# Altium schematic sheet Sheet1.SchDoc
size A4; SheetNumber: 2; SheetTotal: 2
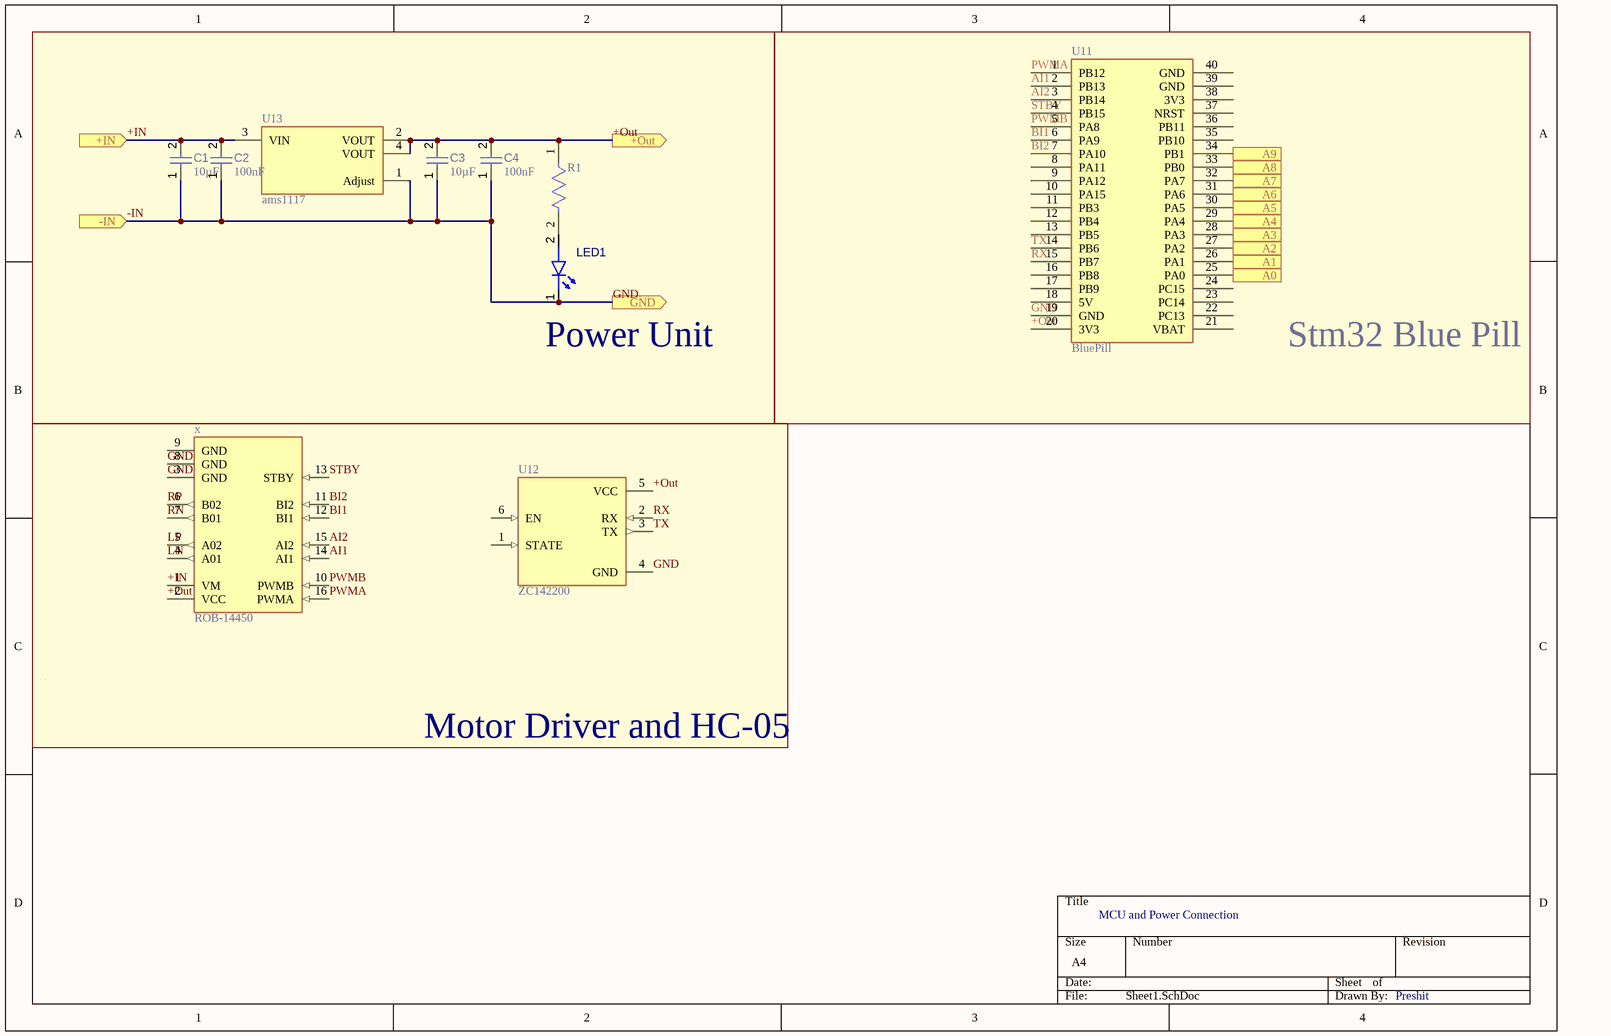
[diagram p0: Sheet1.SchDoc]

## Parts
C1  value 10µF  [CAPC0402(1005)60_L]  (hidden comment: Capacitor 10µF +/-40% 6.3V 0402)
C2  value 100nF  [CAPC0402(1005)60_L]  (hidden comment: Capacitor 100nF +/-20% 10V 0402)
C3  value 10µF  [CAPC0402(1005)60_L]  (hidden comment: Capacitor 10µF +/-40% 6.3V 0402)
C4  value 100nF  [CAPC0402(1005)60_L]  (hidden comment: Capacitor 100nF +/-20% 10V 0402)
LED1  QBLP595-IB  [QTB-QBLP595_V]  (value not drawn)
R1  RN73R2BTTD1001F25  [FP-RN73R2B-MFG]  (value not drawn)
U11  BluePill  [Stm32 BluePill]
U12  ZC142200  [MODULE_ZC142200]
U13  ams1117  [FP-ams1117-IPC_C]
x  ROB-14450  [MODULE_ROB-14450]

## Blocks framed on the sheet
Power Unit: C1-C4 LED1 R1 U13
Stm32 Blue Pill: U11
Motor Driver and HC-05: U12 x

## Ports
+IN (in), +Out (out, see Sheet2[1A], Sheet2[1B], Sheet2[1C], Sheet2[1D], Sheet2[2A], Sheet2[2B], Sheet2[2C], Sheet2[3A], Sheet2[3B], Sheet2[3C], Sheet2[4A], Sheet2[4B], Sheet2[4C]), -IN (in), A0 (in, see Sheet2[2D]), A1 (in, see Sheet2[2A]), A2 (in, see Sheet2[3A]), A3 (in, see Sheet2[4A]), A4 (in, see Sheet2[2B]), A5 (in, see Sheet2[3B]), A6 (in, see Sheet2[4B]), A7 (in, see Sheet2[2C]), A8 (in, see Sheet2[3C]), A9 (in, see Sheet2[4C]), GND (out, see Sheet2[1B], Sheet2[1C], Sheet2[1D], Sheet2[2B], Sheet2[2C], Sheet2[2D], Sheet2[3B], Sheet2[3C], Sheet2[4B], Sheet2[4C])

## Nets
+IN: C1.2 C2.2 U13.3(VIN) x.1(VM) ; port +IN
+Out: C3.2 C4.2 R1.1 U11.20(3V3) U12.5(VCC) U13.2(VOUT) U13.4(VOUT) x.2(VCC) ; port +Out
-IN: C1.1 C2.1 C3.1 C4.1 LED1.1(K) U11.19(GND) U12.4(GND) U13.1(Adjust) x.3(GND) x.8(GND) ; port -IN, port GND  [also labelled GND]
A0: U11.25(PA0) ; port A0
A1: U11.26(PA1) ; port A1
A2: U11.27(PA2) ; port A2
A3: U11.28(PA3) ; port A3
A4: U11.29(PA4) ; port A4
A5: U11.30(PA5) ; port A5
A6: U11.31(PA6) ; port A6
A7: U11.32(PA7) ; port A7
A8: U11.33(PB0) ; port A8
A9: U11.34(PB1) ; port A9
AI1: U11.2(PB13) x.14(AI1)
AI2: U11.3(PB14) x.15(AI2)
BI1: U11.6(PA9) x.12(BI1)
BI2: U11.7(PA10) x.11(BI2)
LN: x.4(A01)
LP: x.5(A02)
PWMA: U11.1(PB12) x.16(PWMA)
PWMB: U11.5(PA8) x.10(PWMB)
RN: x.7(B01)
RP: x.6(B02)
RX: U11.15(PB7) U12.2(RX)
STBY: U11.4(PB15) x.13(STBY)
TX: U11.14(PB6) U12.3(TX)
NetLED1_2: LED1.2(A) R1.2

Not connected (* = marked no-connect by the designer): U11 8(PA11) 9(PA12) 10(PA15) 11(PB3) 12(PB4) 13(PB5) 16(PB8) 17(PB9) 18(5V) 21(VBAT) 22(PC13) 23(PC14) 24(PC15) 35(PB10) 36(PB11) 37(NRST) 38(3V3) 39(GND) 40(GND); U12 1(STATE) 6(EN); x 9(GND)

## Notes on the sheet
- MCU and Power Connection
- Preshit

## Library data of the parts
C1 C3 = CMP-001-00074-3: Chip Capacitor, 10µF +/-40%, 6.3V, 0402, Thickness 0.6 mm; Tolerance: 10%; Case/Package: 0402; Pins: 2; Mounting Technology: SMT; Voltage Rating: 6.3V; Max Operating Temperature: 85°C; Min Operating Temperature: -55°C
C2 C4 = CMP-001-00061-3: Chip Capacitor, 100nF +/-20%, 10V, 0402, Thickness 0.6 mm; Tolerance: 20%; Mounting Technology: SMT; Voltage Rating: 10V; Max Operating Temperature: 85°C; Pins: 2; Case/Package: 0402; Min Operating Temperature: -55°C
LED1 = CMP-007-00042-3: Chip LED 0402, Blue, 0.02 A, 3.1 to 3.7 V, -40 to 80 degC, 2-Pin SMD, RoHS, Tape and Reel; RoHS Compliant: Yes; Colour: Blue; Pins: 2; Case/Package: 0402; Mounting Technology: SMT
R1 = CMP-04015-029161-1: 1kΩ ±1% 0.25W, 1/4W Chip Resistor 1206 (3216 Metric) Moisture Resistant Thin Film
U11 = CMP-00030-00001-1: Designed By @Alixahedi; Pins: 40; Component Type: Standard; Design Item ID: BluePill; Source: Schlib1.SchLib
U12 = CMP-011-000000-1: 1pc HC-05 6 Pin Wireless Bluetooth RF Transceiver Module Serial For Arduino; MF: YKS; SnapEDA_Link: https://www.snapeda.com/parts/ZC142200/YKS/view-part/?ref=snap; Check_prices: https://www.snapeda.com/parts/ZC142200/YKS/view-part/?ref=eda; Pin Count: 6; Value: *; Design Item ID: ZC142200; Package: None; MP: ZC142200; Source: ZC142200.SchLib; Component Type: Standard
U13 = CMP-209535-000002-1: 1A LOW DROPOUT VOLTAGE REGULATOR; RoHS Compliant: Yes
x = CMP-009-000000-1: TB6612FNG Motor Controller/Driver Power Management Evaluation Board; MF: SparkFun Electronics; Availability: In Stock; Check_prices: https://www.snapeda.com/parts/ROB-14450/SparkFun%20Electronics/view-part/2656367/?ref=eda; Component Type: Standard; Price: None; Design Item ID: ROB-14450; Pin Count: 16; Source: ROB-14450.SchLib; Value: *; MP: ROB-14450; Package: None; SnapEDA_Link: https://www.snapeda.com/parts/ROB-14450/SparkFun%20Electronics/view-part/2656367/?ref=snap